# EAGLE design test (EAGLE 5.11)
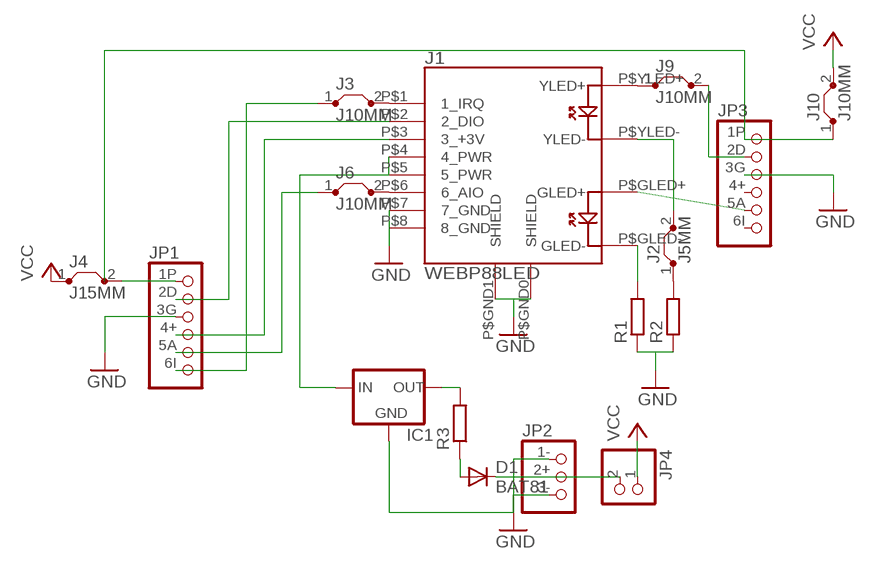
[diagram p0: schematic, sheet 1]

## Parts
D1  BAT81  [DO34-7]
IC1  78LXX  [78LXX]
J1  WEBP88LED  [WEBP88LED]
J2  J5MM  [05]
J3  J10MM  [10]
J4  J15MM  [15]
J6  J10MM  [10]
J9  J10MM  [10]
J10  J10MM  [10]
JP1  JEENODEPORT  [JEENODEPORT]
JP2  PWR3PIN  [PWR3PIN]
JP3  JEENODEPORT  [JEENODEPORT]
JP4  PINHD-1X2  [1X02]
R1  R-EU_0207/7  [0207/7]
R2  R-EU_0207/7  [0207/7]
R3  R-EU_0204/7  [0204/7]

## Nets
GND: IC1.GND J1.P$7(7_GND) J1.P$8(8_GND) J1.P$GND0(SHIELD) J1.P$GND1(SHIELD) JP1.3G JP2.1- JP2.3- JP3.3G R1.1 R2.1
N$1: J1.P$GLED-(GLED-) R1.2
N$2: J1.P$YLED-(YLED-) J2.2
N$3: D1.A R3.1
N$4: D1.C JP2.2+ JP4.2
N$5: IC1.IN J1.P$4(4_PWR) J1.P$5(5_PWR)
N$6: J3.1 JP1.6I
N$7: J1.P$2(2_DIO) JP1.2D
N$8: J1.P$3(3_+3V) JP1.4+
N$9: J6.1 JP1.5A
N$10: J9.2 JP3.2D
N$11: J1.P$GLED+(GLED+) JP3.5A
N$12: IC1.OUT R3.2
N$13: J4.2 JP1.1P
N$14: J10.1 JP3.1P
N$15: J2.1 R2.2
N$16: J1.P$YLED+(YLED+) J9.1
N$17: J1.P$1(1_IRQ) J3.2
N$18: J1.P$6(6_AIO) J6.2
VCC: J4.1 J10.2 JP4.1
Unconnected: JP3.4+ JP3.6I

## Library data of the parts
D1 = diode:BAT81: DIODE barrier diode
IC1 = v-reg:78LXX: VOLTAGE REGULATOR
J1 = Prcek:WEBP88LED
J2-J4 J6 J9 J10 = jumper:J: Bridge
JP1 JP3 = Prcek:JEENODEPORT: JeeNode Port
JP2 = Prcek:PWR3PIN: Power 3 PIN
JP4 = pinhead:PINHD-1X2: PIN HEADER
R1-R3 = resistor:R-EU_: RESISTOR, European symbol

## Board
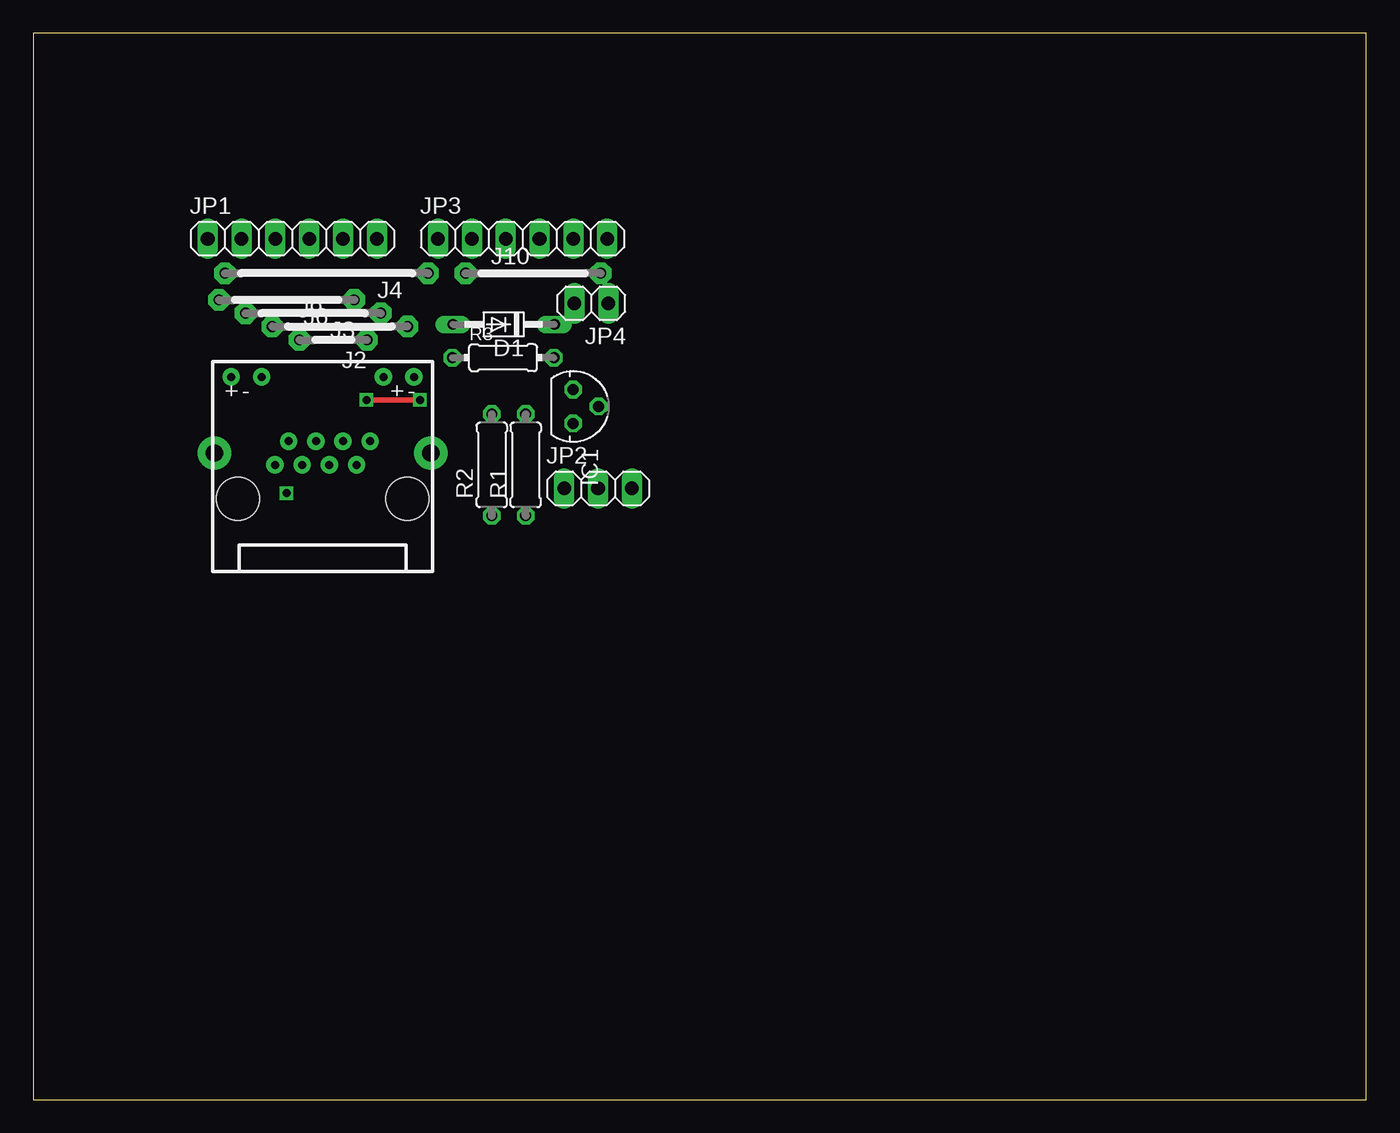
[diagram p1: board, top side]
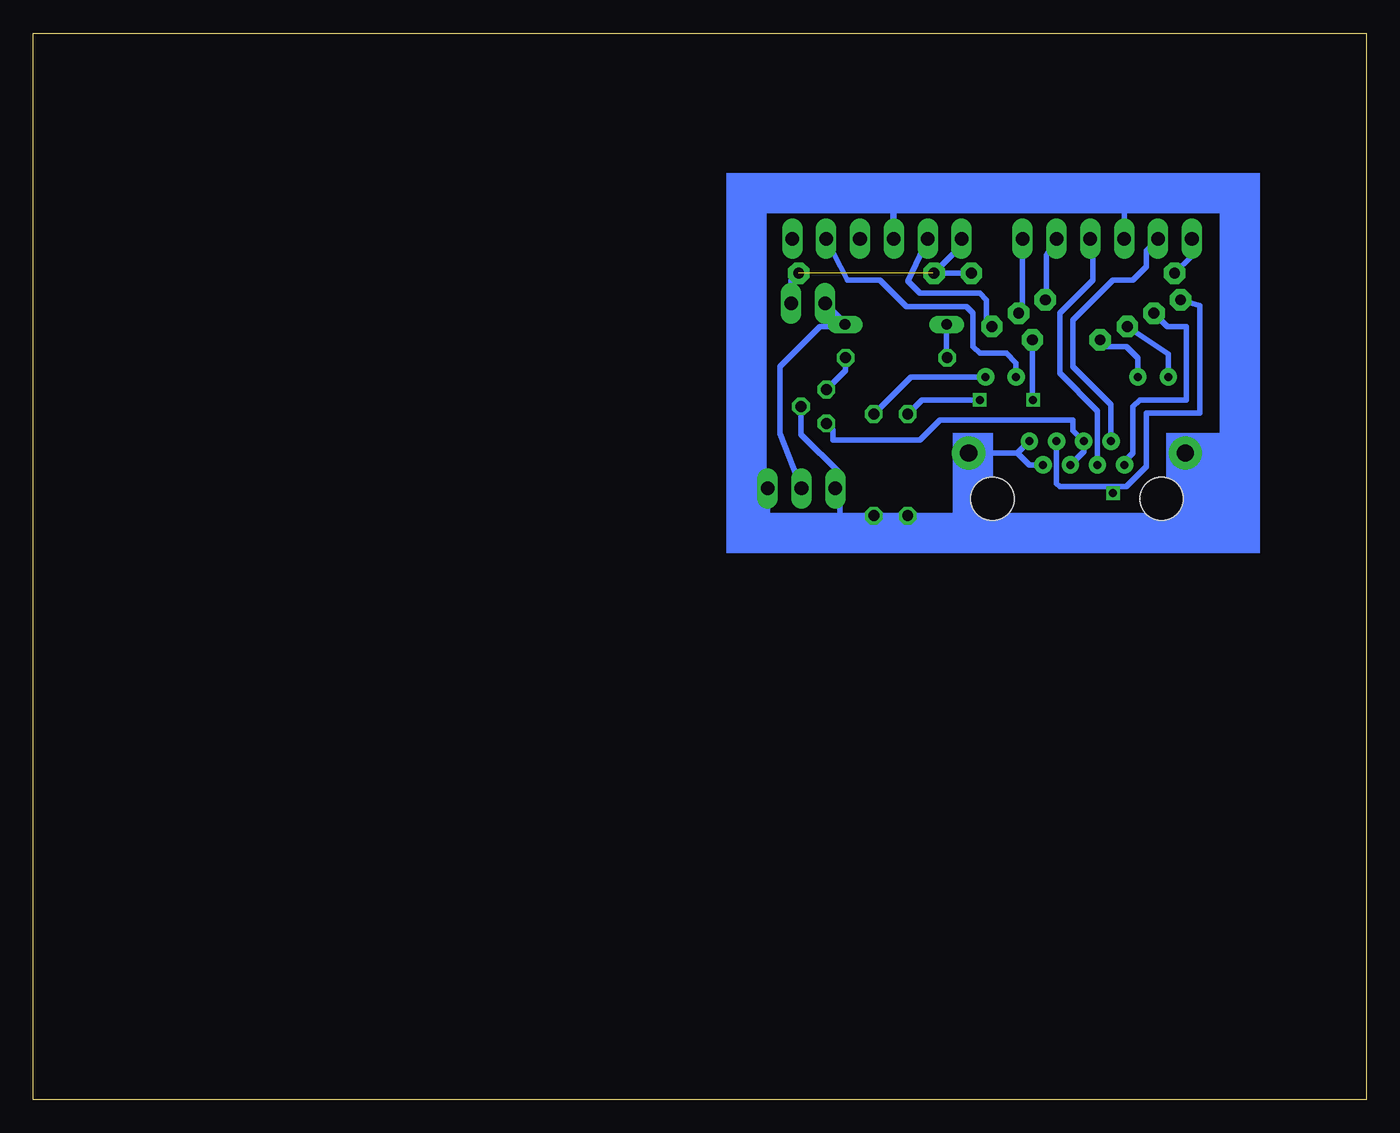
[diagram p2: board, bottom side, seen from below]

Size 100 x 80 mm. Coordinates in mm from the lower left corner, seen from the top.
Outline: 0,0 100,0 100,80 0,80 0,0
Copper layers (1*16): Top 0.035mm / dielectric 1.5mm / Bottom 0.035mm
Design rules "default": minimum track width 10mil, minimum drill 24mil, track to track 8mil, track to pad 8mil, pad to pad 8mil, via to via 8mil, smd to smd 8mil, copper to edge 40mil, drill to drill 8mil, minimum pad ring 10mil, minimum via ring 8mil, stop-mask expansion 4mil, vias tented up to drill 0mil, thermal gap 10mil

### Footprints (pad centres in the part's own frame; a part is rotated, then mirrored left to right if it is on the bottom)
DO34-7 = drill 0.813 long: A 3.81,0; C -3.81,0
78LXX = drill 0.813 octagon: GND 0,1.905; IN 1.27,0; OUT -1.27,0
WEBP88LED = drill 0.6 pad 1.3 round: P$1 -3.57,2.54; P$2 -2.55,4.32; P$3 -1.53,2.54; P$4 -0.5,4.32; P$5 0.5,2.54; P$6 1.53,4.32; P$7 2.55,2.54; P$8 3.57,4.32; P$GLED+ 4.57,9.14; P$GLED- 6.86,9.14; P$YLED+ -6.86,9.14; P$YLED- -4.57,9.14 | drill 1.3 pad 2.5 round: P$GND0 -8.125,3.43; P$GND1 8.125,3.43 | hole 3.25: -6.35,0; 6.35,0
05 = drill 0.813 pad 1.6 octagon: 1 -2.54,0; 2 2.54,0
10 = drill 0.813 pad 1.6 octagon: 1 -5.08,0; 2 5.08,0
15 = drill 0.813 pad 1.6 octagon: 1 -7.62,0; 2 7.62,0
JEENODEPORT = drill 1.016 long: 1P -6.35,0; 2D -3.81,0; 3G -1.27,0; 4+ 1.27,0; 5A 3.81,0; 6I 6.35,0
PWR3PIN = drill 1.016 long: 1- -2.54,0; 2+ 0,0; 3- 2.54,0
1X02 = drill 1.016 long: 1 -1.27,0; 2 1.27,0
0207/7 = drill 0.813 octagon: 1 -3.81,0; 2 3.81,0
0204/7 = drill 0.813 octagon: 1 -3.81,0; 2 3.81,0

### Placement (x,y rotation side)
D1  35.29,58.16 180 top
IC1  40.5,52 270 top
J1  21.7,45.08 0 top
J2  22.5,57 180 top
J3  21,59 180 top
J4  22,62 180 top
J6  19,60 180 top
J9  23,58 0 top
J10  37.5,62 0 top
JP1  19.43,64.59 0 top
JP2  42.37,45.85 0 top
JP3  36.71,64.59 0 top
JP4  41.87,59.74 180 top
R1  36.94,47.62 90 top
R2  34.4,47.62 90 top
R3  35.25,55.66 0 top

### Tracks (layer width: path | path; a pad name or v marks a point on that pad's centre or on a via)
GND
  Bottom 0.406: R2.1 R1.1 30.59,43.81 | J1.P$GND0 13.57,48.38 12.81,47.62 12.81,42.54 30.59,42.54 | 30.59,43.81 30.59,42.54 | 30.59,43.81 30.59,47.74 J1.P$GND1 | J1.P$GND1 26.16,48.51 | 26.16,48.51 J1.P$8 | J1.P$7 25.27,47.62 26.16,48.51 | J1.P$GND1 29.82,42.17 30,42 13,42 13,49 | 30.59,42.54 44.96,42.54 | 44.96,42.54 45,42.5 | 45,42.5 45,45.76 JP2.3- 44.91,42.59 44.96,42.54 | 45,42.5 39.5,42.5 39.5,43 | 39.5,43 39.5,45.52 JP2.1- 39.5,46.18 39.5,47 42.41,49.91 IC1.GND | 35.5,67.5 18,67.5 18.16,67.34 JP1.3G | 35.5,67.5 35.5,64.65 JP3.3G 35.44,67.44 35.5,67.5 | 35.5,67.5 47,67.5 47,42.5 40,42.5 39.5,43
N$1
  Bottom 0.406: J1.P$GLED- 34.15,54.22 R1.2
N$2
  Bottom 0.406: J1.P$YLED- 17.13,55.63 18,56.5 19.46,56.5 J2.2
N$3
  Bottom 0.406: D1.A 31.48,55.7 R3.1
N$4
  Bottom 0.406: D1.C 39.1,58.24 JP4.2 40.6,59.6 39,58 41,58 44,55 44,49.98 JP2.2+
N$5
  Bottom 0.406: J1.P$5 21.2,48.62 J1.P$4 22,50.2 22,51 32,51 33.5,49.5 40,49.5 40,50.23 IC1.IN
N$6
  Bottom 0.406: JP1.6I 25.78,59.3 J3.1
N$7
  Bottom 0.406: J1.P$2 19.15,52.15 22,55 22,58.5 19,61.5 17.5,61.5 16.5,62.5 16.5,63.71 JP1.2D
N$8
  Bottom 0.406: J1.P$3 20.17,51.67 23,54.5 23,59 20.5,61.5 20.5,64.39 JP1.4+
N$9
  Bottom 0.406: JP1.5A 24,63.35 24,60.08 J6.1
N$10
  Bottom 0.406: JP3.2D 34.4,61.4 33.5,60.5 29,60.5 28.5,60 28.5,58.42 J9.2
N$11
  Bottom 0.406: J1.P$GLED+ 26.27,55.27 27,56 29,56 29.5,56.5 29.5,59 30,59.5 34.5,59.5 36.5,61.5 38.93,61.5 JP3.5A
N$12
  Bottom 0.406: R3.2 39.06,54.71 IC1.OUT
N$13
  Bottom 0.406: JP1.1P 13.08,63.3 J4.2
N$14
  Bottom 0.406: JP3.1P 30.36,64.06 J10.1
N$15  (via drill 0.6)
  Top 0.406: v25,52.5 v29,52.5
  Bottom 0.406: J2.1 25.04,52.54 v25,52.5 | v29,52.5 33.33,52.5 R2.2
N$16
  Bottom 0.406: J1.P$YLED+ 14.84,55.92 J9.1
N$17
  Bottom 0.406: J1.P$1 18.13,47.87 17.5,48.5 17.5,52 17,52.5 13.5,52.5 13.5,58 14.92,58 J3.2
N$18
  Bottom 0.406: J1.P$6 23.23,46.23 23,46 18,46 16.5,47.5 16.5,51.5 12.5,51.5 12.5,59.58 J6.2
N$19  (via drill 0.6)
  other vias: 19,45.5
VCC  (1 unrouted)
  Bottom 0.406: JP4.1 43.14,61.44 J10.2 | J4.1 32.5,62
(copper drawn outside any net)
  shapes: Bottom area x18